# Altium project QN8035_Radio.PrjPcb
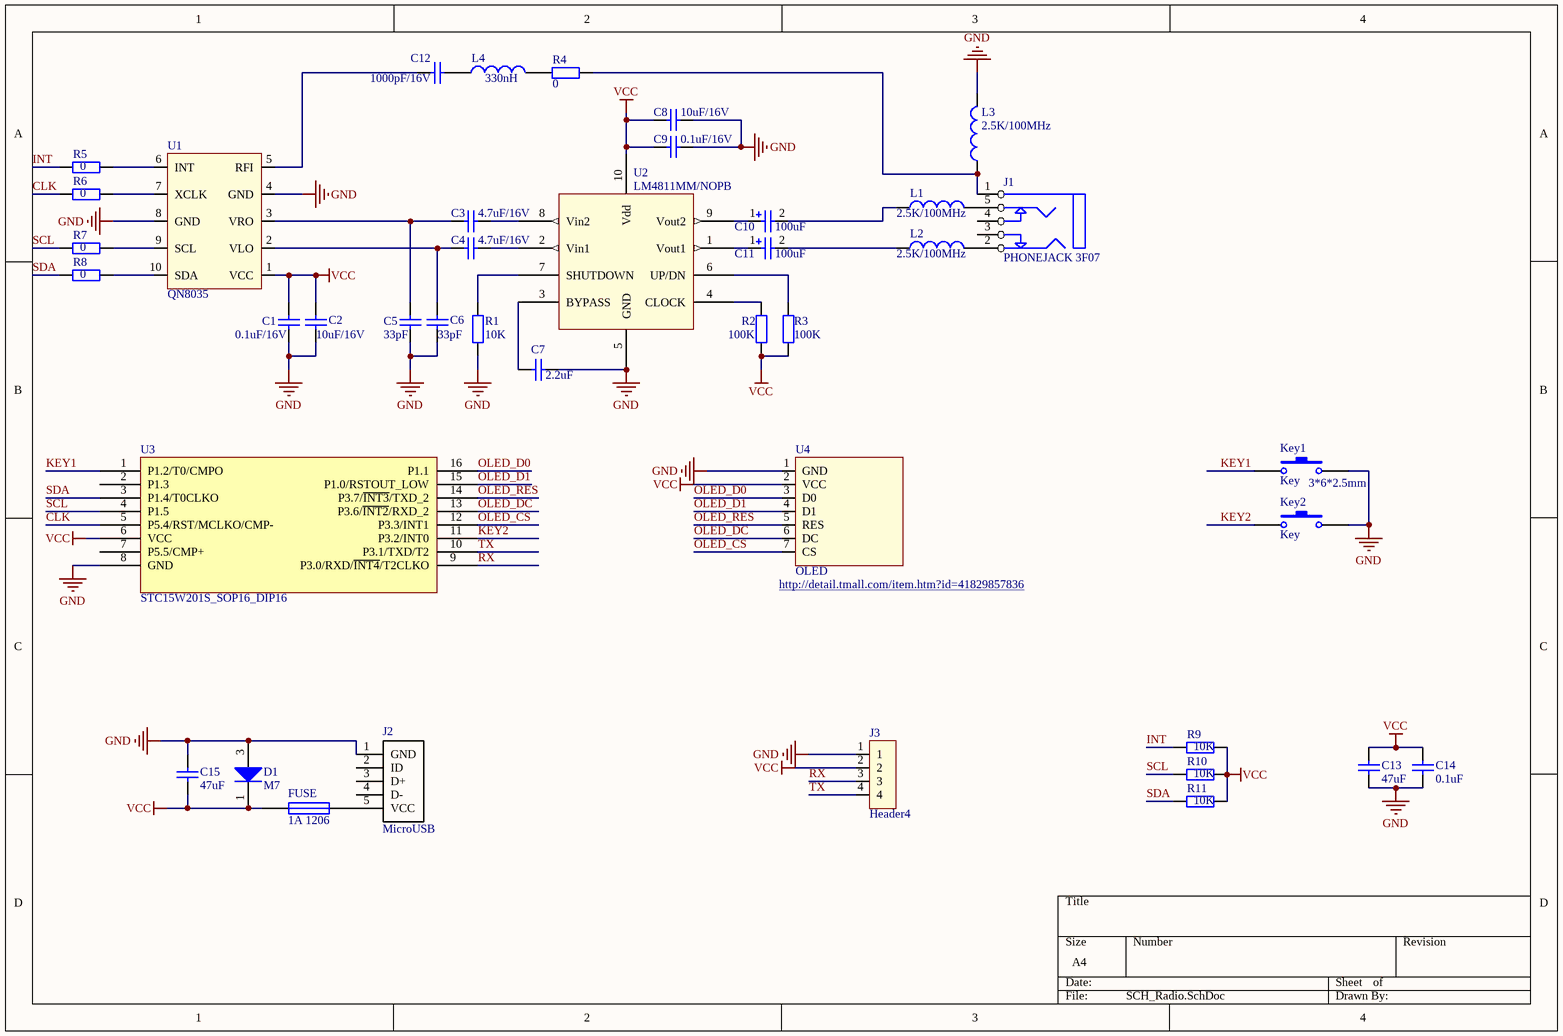
[diagram p0: SCH_Radio.SchDoc]
1 sheet, 41 parts. Net scope: global (net labels, ports and power ports of the same name join across sheets).
Board file: PCB_Radio.PcbDoc

## Sheet SCH_Radio.SchDoc
size A4

### Parts
C1  value 0.1uF/16V  [0603]  (hidden comment: Cap)
C2  value 10uF/16V  [0805]  (hidden comment: Cap)
C3  value 4.7uF/16V  [0603]  (hidden comment: Cap)
C4  value 4.7uF/16V  [0603]  (hidden comment: Cap)
C5  value 33pF  [0603]  (hidden comment: Cap)
C6  value 33pF  [0603]  (hidden comment: Cap)
C7  value 2.2uF  [0603]  (hidden comment: Cap)
C8  value 10uF/16V  [0805]  (hidden comment: Cap)
C9  value 0.1uF/16V  [0603]  (hidden comment: Cap)
C10  value 100uF  [6032]  (hidden comment: Cap Pol2)
C11  value 100uF  [6032]  (hidden comment: Cap Pol2)
C12  value 1000pF/16V  [0603]  (hidden comment: Cap)
C13  value 47uF  [0805]  (hidden comment: Cap)
C14  value 0.1uF  [0603]  (hidden comment: Cap)
C15  value 47uF  [0805]  (hidden comment: Cap)
D1  M7  [DO-214AC]
FUSE  1A 1206  [1206]
J1  PHONEJACK 3F07  [3F07]
J2  MicroUSB  [MicroUSB]
J3  Header4  [HEADER4]
Key1  Key  g: 3*6*2.5mm  [key]
Key2  Key  [key]
L1  value 2.5K/100MHz  [0603]  (hidden comment: Inductor)
L2  value 2.5K/100MHz  [0603]  (hidden comment: Inductor)
L3  value 2.5K/100MHz  [0603]  (hidden comment: Inductor)
L4  value 330nH  [0603]  (hidden comment: Inductor)
R1  value 10K  [0603]  (hidden comment: Res2)
R2  value 100K  [0603]  (hidden comment: Res2)
R3  value 100K  [0603]  (hidden comment: Res2)
R4  value 0  [0603]  (hidden comment: Res2)
R5  value 0  [0603]  (hidden comment: Res2)
R6  value 0  [0603]  (hidden comment: Res2)
R7  value 0  [0603]  (hidden comment: Res2)
R8  value 0  [0603]  (hidden comment: Res2)
R9  value 10K  [0603]  (hidden comment: Res2)
R10  value 10K  [0603]  (hidden comment: Res2)
R11  value 10K  [0603]  (hidden comment: Res2)
U1  QN8035  [SOP10]
U2  LM4811MM/NOPB  [MUB10Am]
U3  STC15W201S_SOP16_DIP16  [SOP16]
U4  OLED  [OLED_0.96]

### Nets
GND: C1.1 C2.1 C5.1 C6.1 C7.2 C8.2 C9.2 C13.2 C14.2 C15.1 D1.3(A) J2.1(GND) J3.1 Key1.2 Key2.2 L3.2 R1.1 U1.4(GND) U1.8(GND) U2.5(GND) U3.8(GND) U4.1(GND)
VCC: C1.2 C2.2 C8.1 C9.1 C13.1 C14.1 C15.2 D1.1(K) FUSE.1 J3.2 R2.1 R3.1 R9.1 R10.1 R11.1 U1.1(VCC) U2.10(Vdd) U3.6(VCC) U4.2(VCC)
CLK: R6.2 U3.5(P5.4/RST/MCLKO/CMP-)
INT: R5.2 R9.2
KEY1: Key1.1 U3.1(P1.2/T0/CMPO)
KEY2: Key2.1 U3.11(P3.2/INT0)
OLED_CS: U3.12(P3.3/INT1) U4.7(CS)
OLED_D0: U3.16(P1.1) U4.3(D0)
OLED_D1: U3.15(P1.0/RSTOUT_LOW) U4.4(D1)
OLED_DC: U3.13(P3.6/~{INT2}/RXD_2) U4.6(DC)
OLED_RES: U3.14(P3.7/~{INT3}/TXD_2) U4.5(RES)
RX: J3.3 U3.9(P3.0/RXD/~{INT4}/T2CLKO)
SCL: R7.2 R10.2 U3.4(P1.5)
SDA: R8.2 R11.2 U3.3(P1.4/T0CLKO)
TX: J3.4 U3.10(P3.1/TXD/T2)
NetC3_1: C3.1 C5.2 U1.3(VRO)
NetC3_2: C3.2 U2.8(Vin2)
NetC4_1: C4.1 C6.2 U1.2(VLO)
NetC4_2: C4.2 U2.2(Vin1)
NetC7_1: C7.1 U2.3(BYPASS)
NetC10_1: C10.1 U2.9(Vout2)
NetC10_2: C10.2 L1.1
NetC11_1: C11.1 U2.1(Vout1)
NetC11_2: C11.2 L2.1
NetC12_1: C12.1 L4.1
NetC12_2: C12.2 U1.5(RFI)
NetFUSE_2: FUSE.2 J2.5(VCC)
NetJ1_1: J1.1(E) L3.1 R4.1
NetJ1_2: J1.2(A) L2.2
NetJ1_5: J1.5(D) L1.2
NetL4_2: L4.2 R4.2
NetR1_2: R1.2 U2.7(SHUTDOWN)
NetR2_2: R2.2 U2.4(CLOCK)
NetR3_2: R3.2 U2.6(UP/DN)
NetR5_1: R5.1 U1.6(INT)
NetR6_1: R6.1 U1.7(XCLK)
NetR7_1: R7.1 U1.9(SCL)
NetR8_1: R8.1 U1.10(SDA)

Not connected (* = marked no-connect by the designer): J1 3(B) 4(C); J2 2(ID) 3(D+) 4(D-); U3 2(P1.3) 7(P5.5/CMP+)

### Library data of the parts
C1-C9 C12-C15 = Cap: Capacitor; Published: 8-Jun-2000; LatestRevisionDate: 17-Jul-2002; LatestRevisionNote: Re-released for DXP Platform.; PackageReference: RAD-0.3; Publisher: Altium Limited; PackageDescription: Radial Cap, Thru-Hole; 2 Leads; 0.3 in Pin Spacing
C10 C11 = Cap Pol2: Polarized Capacitor (Axial); Published: 8-Jun-2000; LatestRevisionDate: 17-Jul-2002; LatestRevisionNote: Re-released for DXP Platform.; PackageReference: POLAR0.8; Publisher: Altium Limited; PackageDescription: Polarized Capacitor; 2 Leads
D1 = Diode: Default Diode; Published: 8-Jun-2000; LatestRevisionDate: 17-Jul-2002; LatestRevisionNote: Re-released for DXP Platform.; PackageVersion: Sep-1996; PackageReference: SMC; Publisher: Altium Limited; PackageDescription: DO-214-AB/SMC; 2 C-Bend Leads; Body 7.9 x 5.9 mm, inc. leads (LxW); Code_JEDEC: DO-214-AB
FUSE = Fuse 1: Fuse; Published: 8-Jun-2000; LatestRevisionDate: 17-Jul-2002; LatestRevisionNote: Re-released for DXP Platform.; PackageReference: PIN-W2/E2.8; Publisher: Altium Limited; PackageDescription: Thru-Hole; 2 Leads
J1 = PHONEJACK STEREO SW
J2 = MicroUSB: Imported
L1-L4 = Inductor: Code_IEC: 1005; Published: 8-Jun-2000; LatestRevisionDate: 29-May-2009; LatestRevisionNote: IPC-7351 Footprint Added.; PackageReference: 0402-A; Publisher: Altium Limited; PackageDescription: Chip Inductor; Code_JEITA: 0402
R1-R11 = Res2: Resistor; Published: 8-Jun-2000; LatestRevisionDate: 17-Jul-2002; LatestRevisionNote: Re-released for DXP Platform.; PackageReference: AXIAL-0.4; Publisher: Altium Limited; PackageDescription: Axial Device, Thru-Hole; 2 Leads; 0.4 in Pin Spacing
U2 = LM4811MM/NOPB: Imported; Vendor: National Semiconductor; Section: Amplifiers and Comparators; Manufacturer_Part_Number: LM4811MM/NOPB; Family: Audio Amplifier; Manufacturer_Name: National Semiconductor; RS Part Number: 5359802; RefDes: RefDes; Type: DEV; Value: Value
U4 = OLED: URL: http://detail.tmall.com/item.htm?id=41829857836